# EAGLE design PCB_1 (EAGLE 9.6.2)
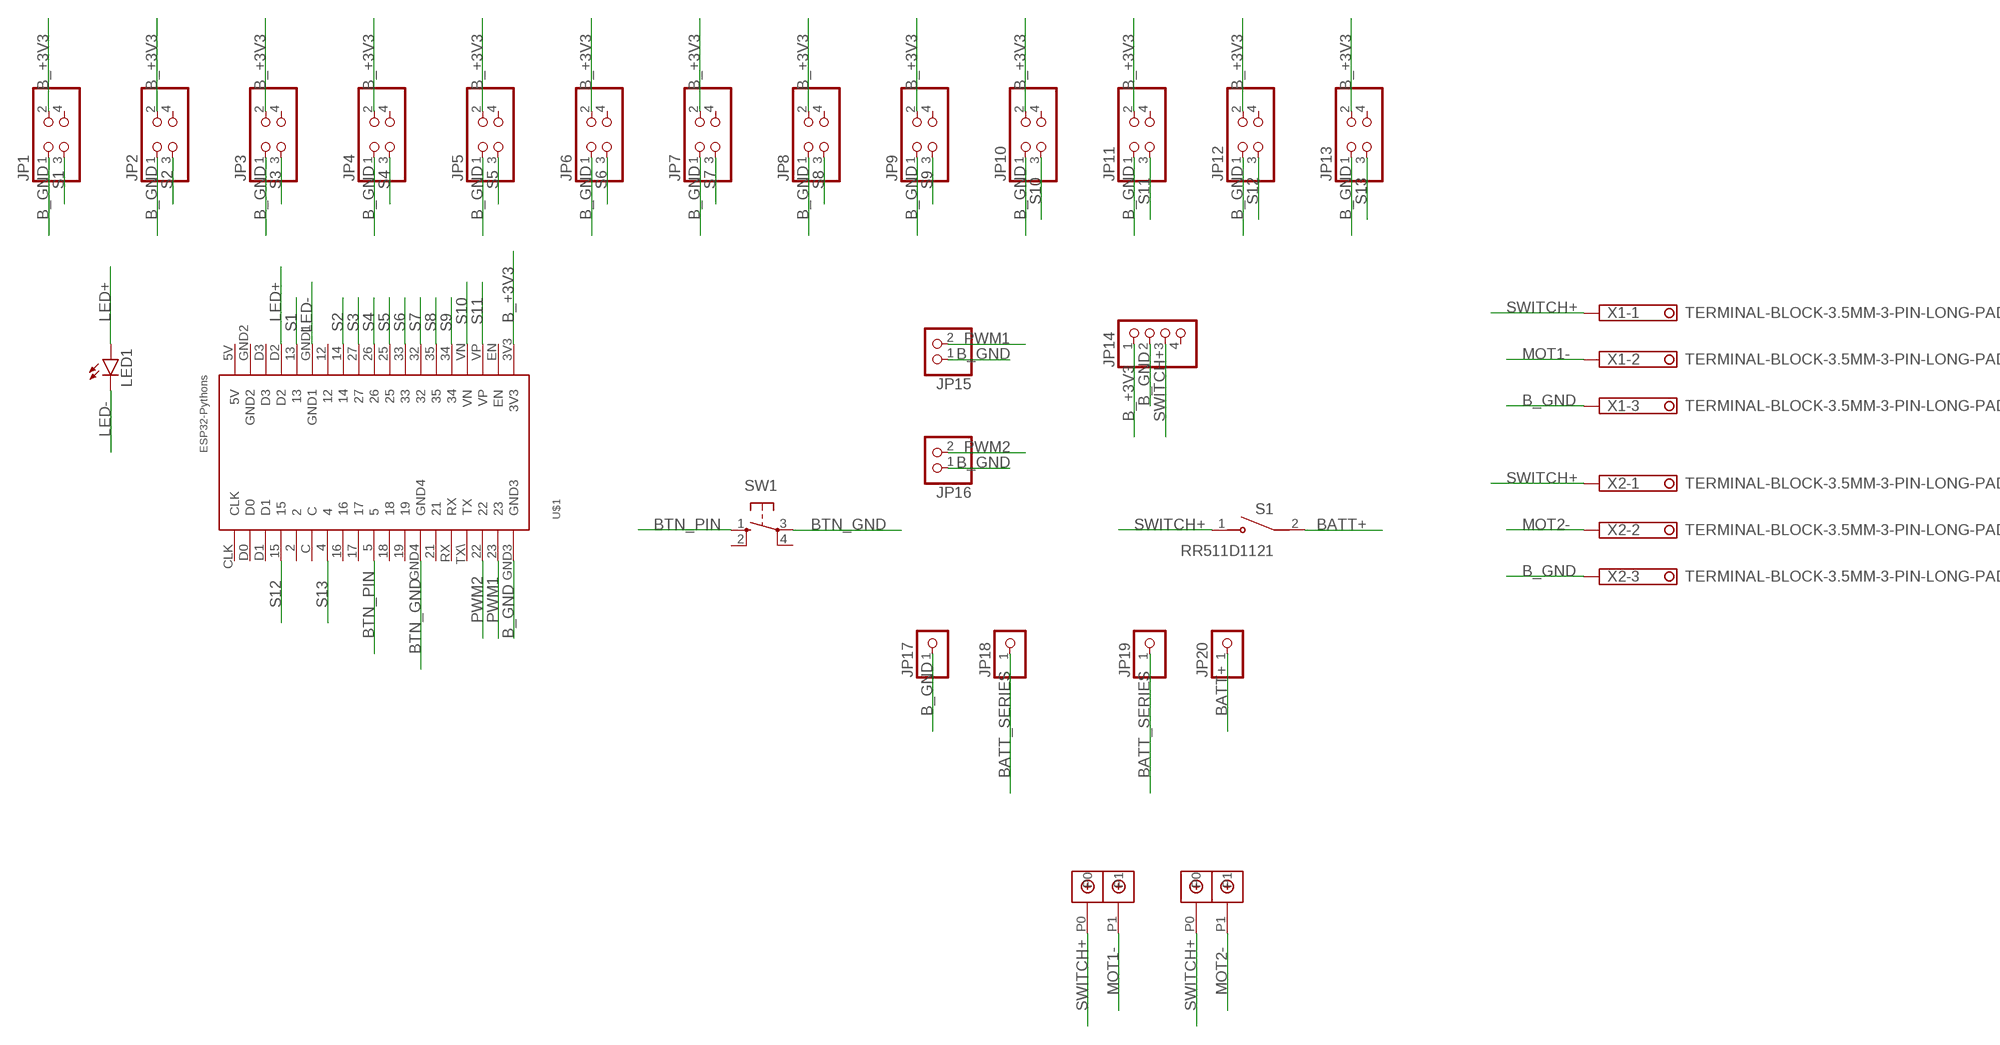
[diagram p0: schematic, sheet 1]

## Parts
JP1  PINHD-2X2  [2X02]
JP2  PINHD-2X2  [2X02]
JP3  PINHD-2X2  [2X02]
JP4  PINHD-2X2  [2X02]
JP5  PINHD-2X2  [2X02]
JP6  PINHD-2X2  [2X02]
JP7  PINHD-2X2  [2X02]
JP8  PINHD-2X2  [2X02]
JP9  PINHD-2X2  [2X02]
JP10  PINHD-2X2  [2X02]
JP11  PINHD-2X2  [2X02]
JP12  PINHD-2X2  [2X02]
JP13  PINHD-2X2  [2X02]
JP14  PINHD-1X4  [1X04]
JP15  PINHD-1X2  [1X02]
JP16  PINHD-1X2  [1X02]
JP17  PINHD-1X1  [1X01]
JP18  PINHD-1X1  [1X01]
JP19  PINHD-1X1  [1X01]
JP20  PINHD-1X1  [1X01]
LED1  LED5MM  [LED5MM]
S1  RR511D1121  [E-SWITCH_RR511D1121]
SW1  10-XX  [B3F-10XX]
U$1  ESP32DEVKITV1  [ESP32-DEVKITV1]
U$2  DBCONN-1X2  [DBCONN-1X2]
U$3  DBCONN-1X2  [DBCONN-1X2]
X1  TERMINAL-BLOCK-3.5MM-3-PIN-LONG-PAD  [TERMINAL-BLOCK-3-PIN-3.5MM-LONG-PAD]
X2  TERMINAL-BLOCK-3.5MM-3-PIN-LONG-PAD  [TERMINAL-BLOCK-3-PIN-3.5MM-LONG-PAD]

## Nets
B_+3V3: JP1.2 JP2.2 JP3.2 JP4.2 JP5.2 JP6.2 JP7.2 JP8.2 JP9.2 JP10.2 JP11.2 JP12.2 JP13.2 JP14.1 U$1.3V3
B_GND: JP1.1 JP2.1 JP3.1 JP4.1 JP5.1 JP6.1 JP7.1 JP8.1 JP9.1 JP10.1 JP11.1 JP12.1 JP13.1 JP14.2 JP15.1 JP16.1 JP17.1 U$1.GND3 X1.3 X2.3
BATT+: JP20.1 S1.2(COM)
BATT_SERIES: JP18.1 JP19.1
BTN_GND: SW1.3(P) U$1.GND4
BTN_PIN: SW1.1(S) U$1.5
LED+: LED1.A U$1.D2
LED-: LED1.K(C) U$1.GND1
MOT1-: U$2.P1 X1.2
MOT2-: U$3.P1 X2.2
PWM1: JP15.2 U$1.23
PWM2: JP16.2 U$1.22
S1: JP1.3 U$1.13
S2: JP2.3 U$1.14
S3: JP3.3 U$1.27
S4: JP4.3 U$1.26
S5: JP5.3 U$1.25
S6: JP6.3 U$1.33
S7: JP7.3 U$1.32
S8: JP8.3 U$1.35
S9: JP9.3 U$1.34
S10: JP10.3 U$1.VN
S11: JP11.3 U$1.VP
S12: JP12.3 U$1.15
S13: JP13.3 U$1.4
SWITCH+: JP14.3 S1.1(NO) U$2.P0 U$3.P0 X1.1 X2.1
Unconnected: JP1.4 JP2.4 JP3.4 JP4.4 JP5.4 JP6.4 JP7.4 JP8.4 JP9.4 JP10.4 JP11.4 JP12.4 JP13.4 JP14.4 SW1.2(S1) SW1.4(P1) U$1.2 U$1.5V U$1.12 U$1.16 U$1.17 U$1.18 U$1.19 U$1.21 U$1.C U$1.CLK U$1.D0 U$1.D1 U$1.D3 U$1.EN U$1.GND2 U$1.RX U$1.TX\(TX)

## Library data of the parts
JP1-JP13 = pinhead:PINHD-2X2: PIN HEADER
JP14 = pinhead:PINHD-1X4: PIN HEADER
JP15 JP16 = pinhead:PINHD-1X2: PIN HEADER
JP17-JP20 = pinhead:PINHD-1X1: PIN HEADER
LED1 = led:LED: LED OSRAM: - CHIPLED LG R971, LG N971, LY N971, LG Q971, LY Q971, LO R971, LY R971 LH N974, LH R974 LS Q976, LO Q976, LY Q976 LO Q996 - Hyper CHIPLED LW Q18S LB Q993, LB Q99A, LB R99A - SideLED LS A670, LO A670, LY A670, LG A670, LP A670 LB A673, LV A673, LT A673, LW A673 LH A674 LY A675 LS A676, LA A676, LO A676, LY A676, LW A676 LS A679, LY A679, LG A679 - Hyper Micro SIDELED® LS Y876, LA Y876, LO Y876, LY Y876 LT Y87S - SmartLED LW L88C, LW L88S LB L89C, LB L89S, LG L890 LS L89K, LO L89K, LY L89K LS L896, LA L896, LO L896, LY L896 - TOPLED LS T670, LO T670, LY T670, LG T670, LP T670 LSG T670, LSP T670, LSY T670, LOP T670, LYG T670 LG T671, LOG T671, LSG T671 LB T673, LV T673, LT T673, LW T673 LH T674 LS T676, LA T676, LO T676, LY T676, LB T676, LH T676, LSB T676, LW T676 LB T67C, LV T67C, LT T67C, LS T67K, LO T67K, LY T67K, LW E67C LS E67B, LA E67B, LO E67B, LY E67B, LB E67C, LV E67C, LT E67C LW T67C LS T679, LY T679, LG T679 LS T770, LO T770, LY T770, LG T770, LP T770 LB T773, LV T773, LT T773, LW T773 LH T774 LS E675, LA E675, LY E675, LS T675 LS T776, LA T776, LO T776, LY T776, LB T776 LHGB T686 LT T68C, LB T68C - Hyper Mini TOPLED® LB M676 - Mini TOPLED Santana® LG M470 LS M47K, LO M47K, LY M47K Source: http://www.osram.convergy.de LUXEON: - LUMILED® LXK2-PW12-R00, LXK2-PW12-S00, LXK2-PW14-U00, LXK2-PW14-V00 LXK2-PM12-R00, LXK2-PM12-S00, LXK2-PM14-U00 LXK2-PE12-Q00, LXK2-PE12-R00, LXK2-PE12-S00, LXK2-PE14-T00, LXK2-PE14-U00 LXK2-PB12-K00, LXK2-PB12-L00, LXK2-PB12-M00, LXK2-PB14-N00, LXK2-PB14-P00, LXK2-PB14-Q00 LXK2-PR12-L00, LXK2-PR12-M00, LXK2-PR14-Q00, LXK2-PR14-R00 LXK2-PD12-Q00, LXK2-PD12-R00, LXK2-PD12-S00 LXK2-PH12-R00, LXK2-PH12-S00 LXK2-PL12-P00, LXK2-PL12-Q00, LXK2-PL12-R00 Source: www.luxeon.com KINGBRIGHT: KA-3528ASYC Source: www.kingbright.com
S1 = RR511D1121:RR511D1121: Check availability <https://pricing.snapeda.com/parts/RR511D1121/E-Switch/view-part?ref=eda>; AVAILABILITY: In Stock; CHECK_PRICES: https://www.snapeda.com/parts/RR511D1121/E-Switch/view-part/?ref=eda; DESCRIPTION: Rocker Switch, RR5 Series, SPST,OFF-ON,Blk Rocker,I/O Legend, 20A, 125VAC, | E-Switch RR511D1121; MF: E-Switch; MP: RR511D1121; PACKAGE: None; PRICE: None; PURCHASE-URL: https://www.snapeda.com/api/url_track_click_mouser/?unipart_id=351624&manufacturer=E-Switch&part_name=RR511D1121&search_term=None; SNAPEDA_LINK: https://www.snapeda.com/parts/RR511D1121/E-Switch/view-part/?ref=snap
SW1 = buttons:10-XX: OMRON SWITCH
U$1 = ESP32-DEVKITV1:ESP32DEVKITV1
U$2 U$3 = Terminal Block Connector:DBCONN-1X2
X1 X2 = Rembrandt Electronics - Terminal Block 3-5mm v1-0:TERMINAL-BLOCK-3.5MM-3-PIN: Terminal Block 3.5mm Pitch: 3,5 mm Number of pins: 3 Created by Rembrandt Electronics www.rembrandtelectronics.com

## Board
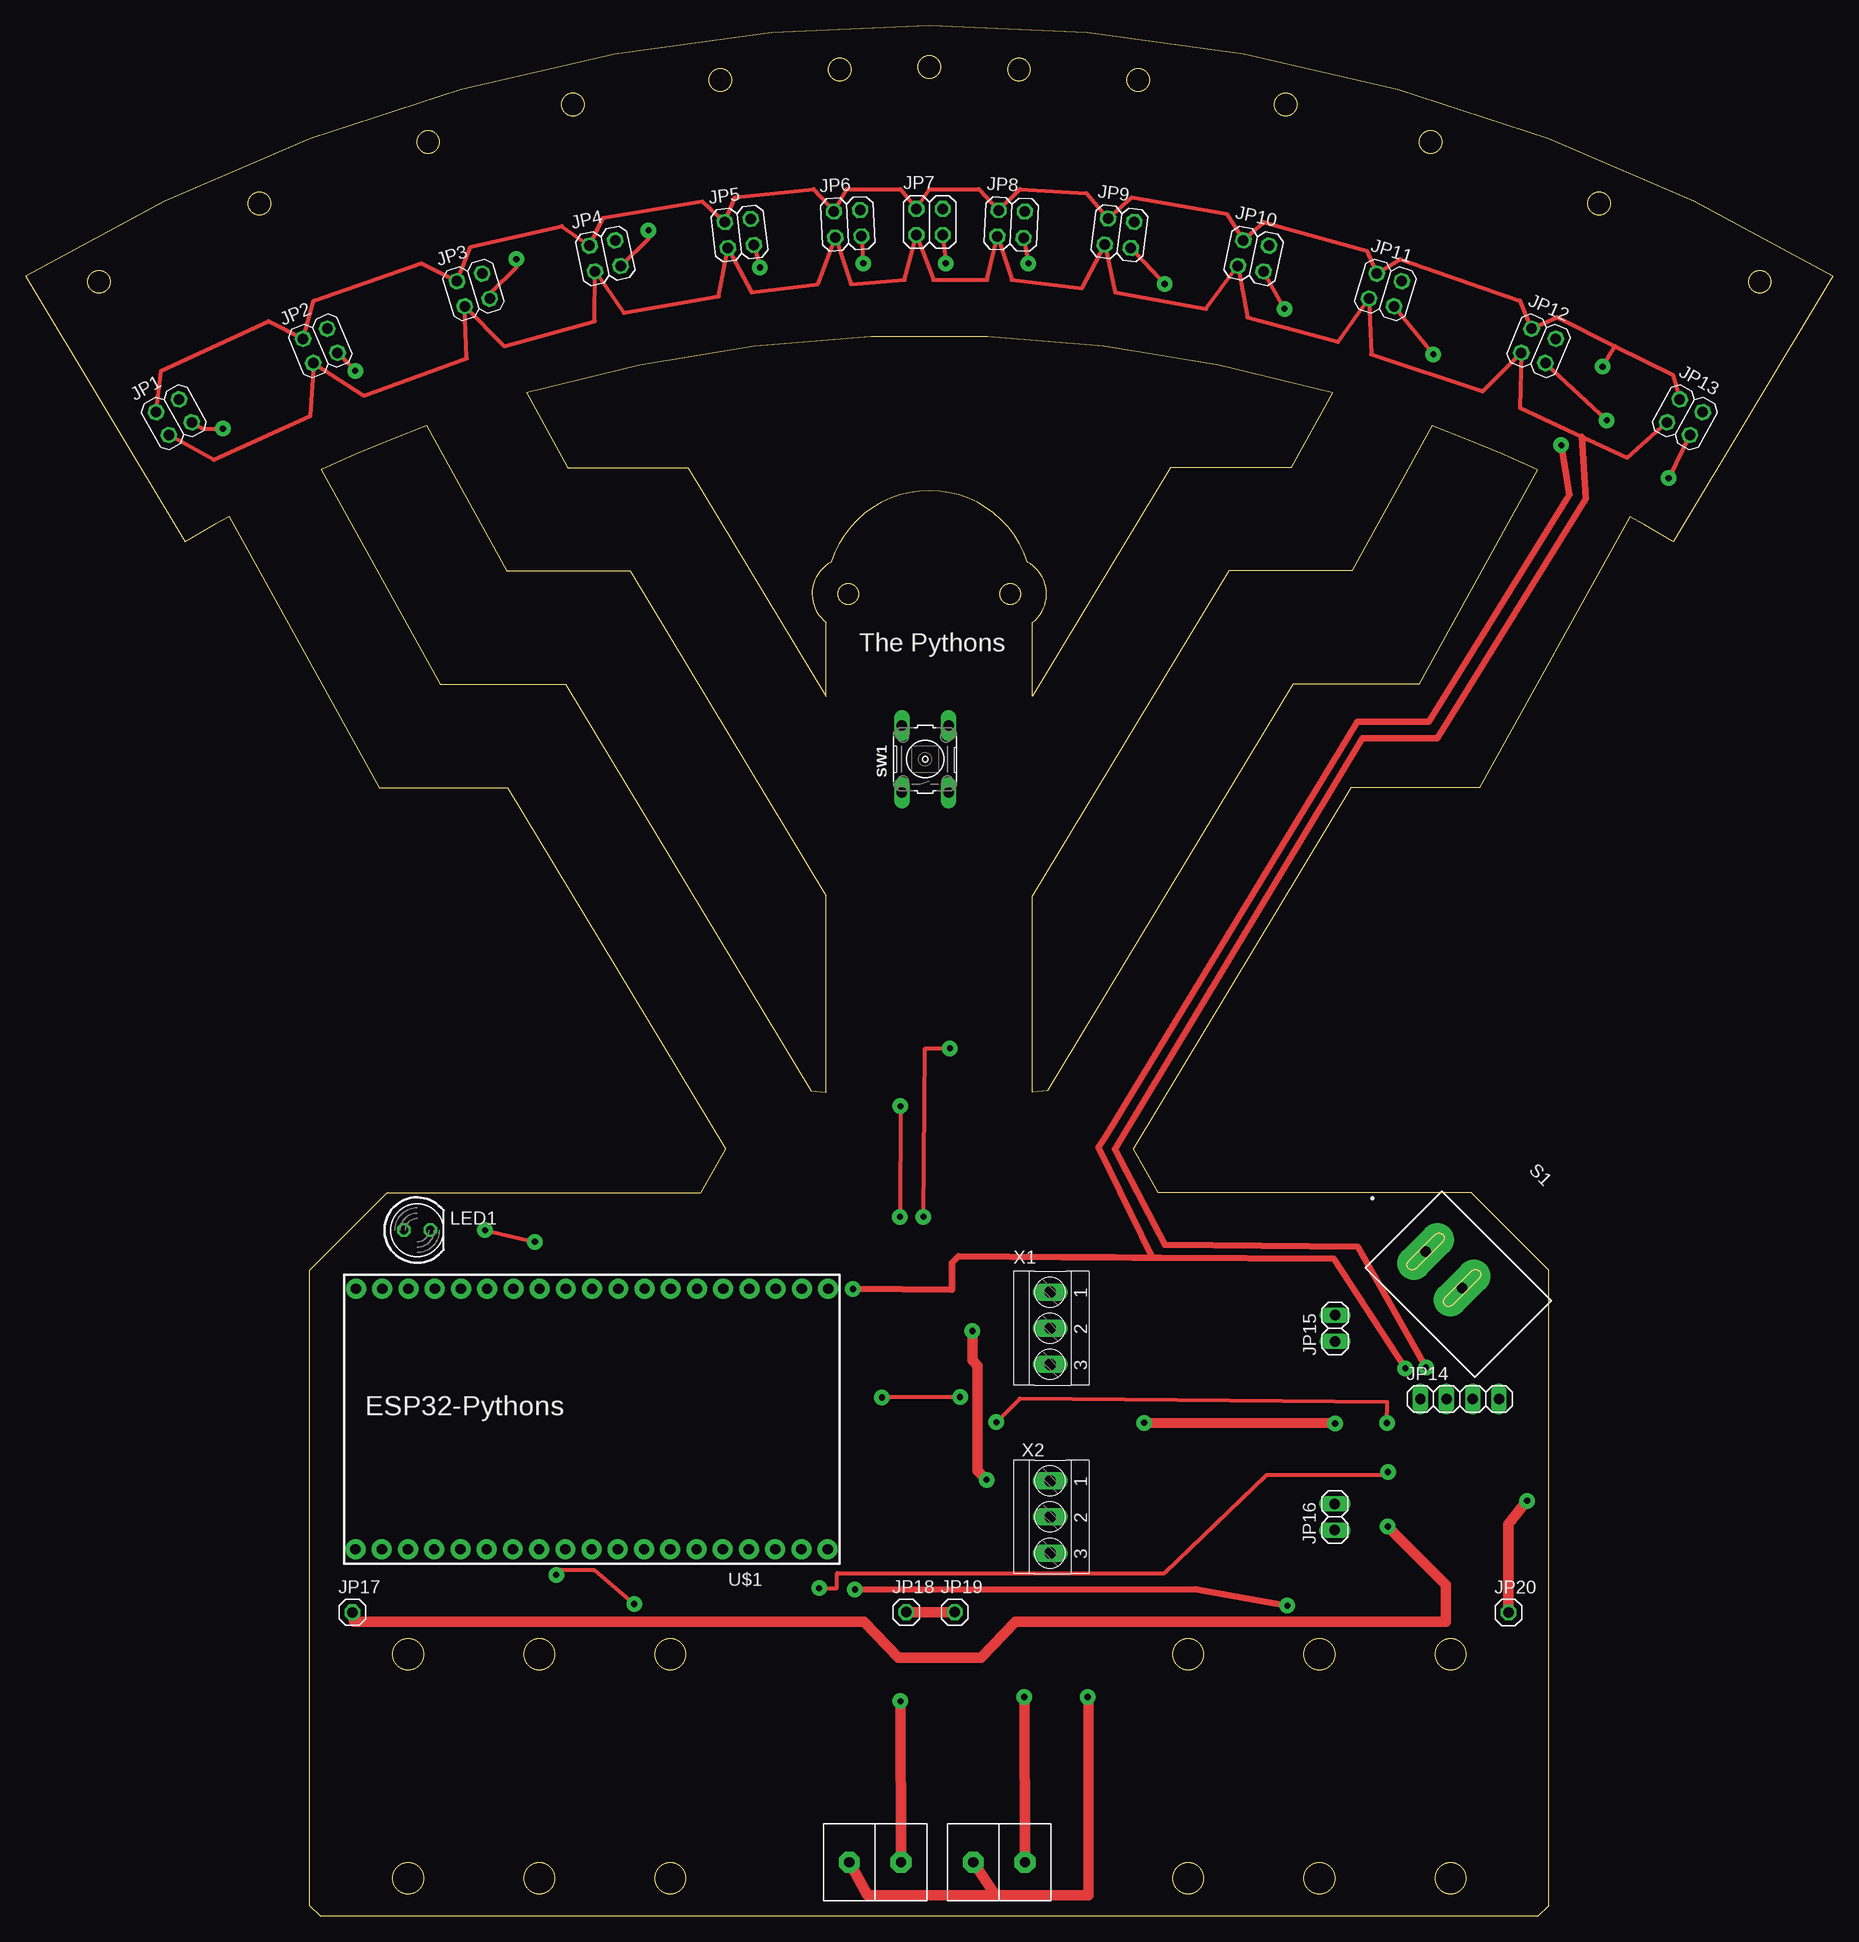
[diagram p1: board, top side]
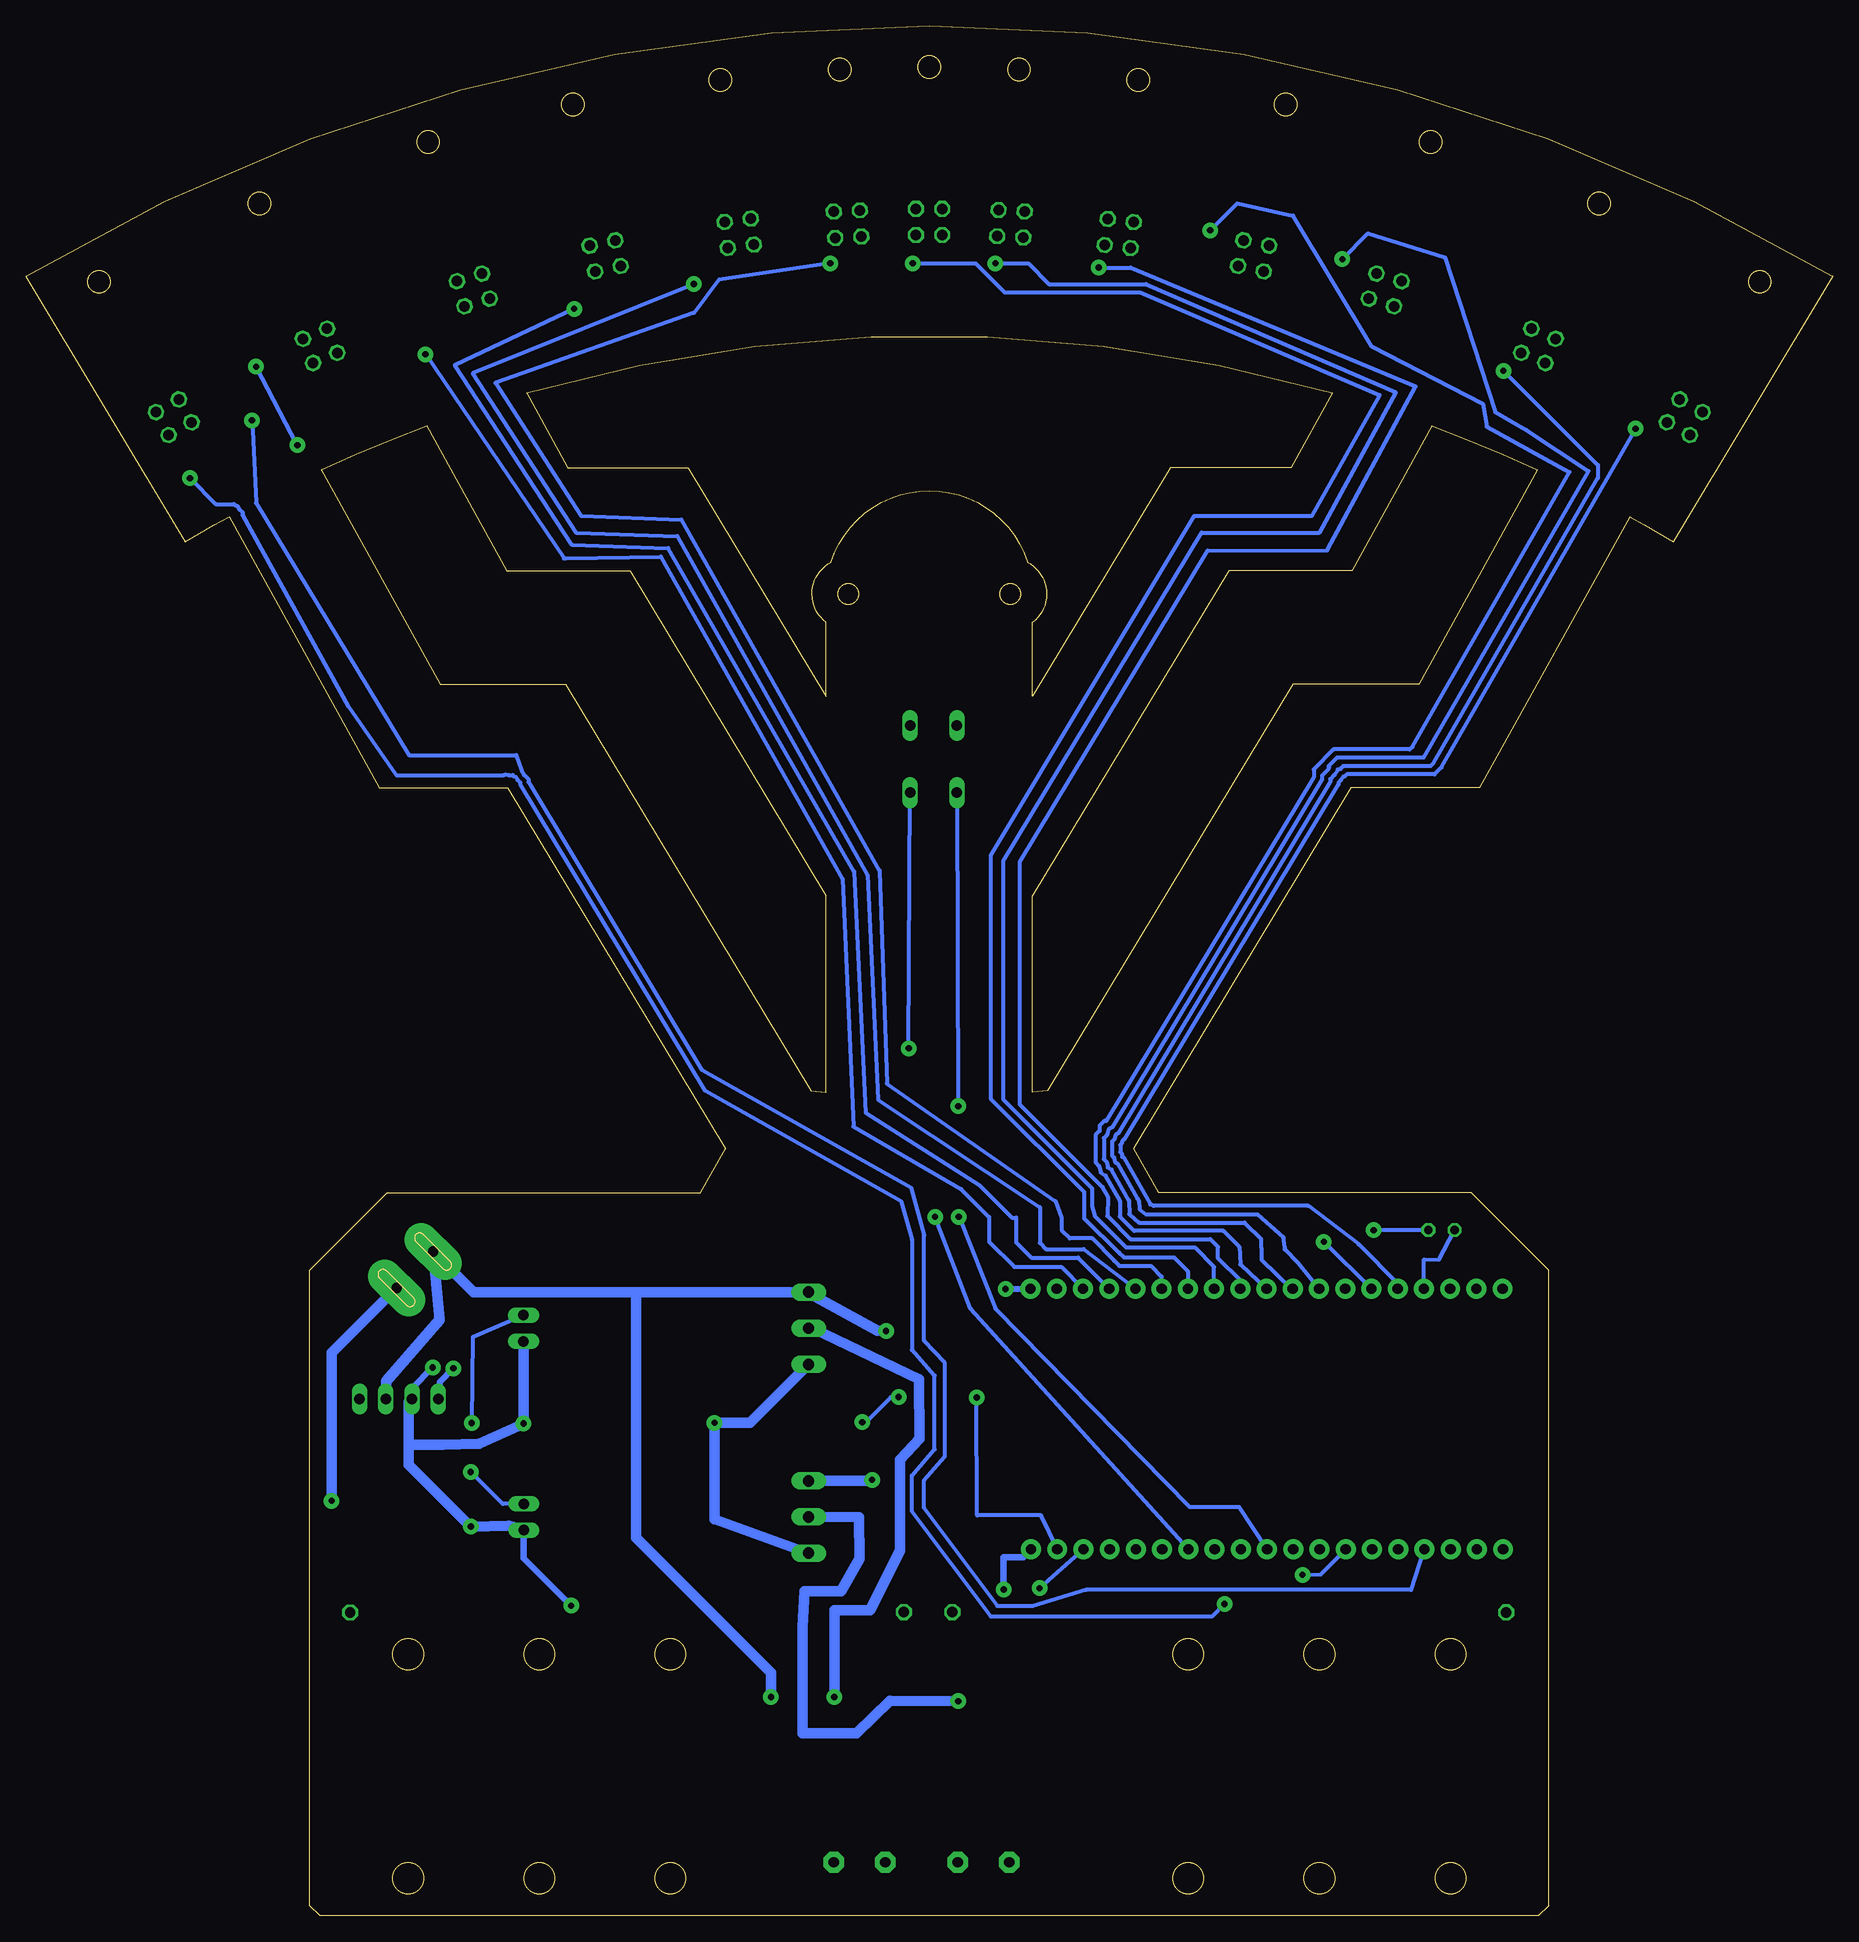
[diagram p2: board, bottom side, seen from below]

Size 175 x 183 mm. Coordinates in mm from the lower left corner, seen from the top.
Outline: 155.33,135.47 155.33,135.47
Outline: 155.33,135.47 140.79,109.23 128.35,109.23 107.25,74.28 109.67,70 140,70 147.5,62.5 147.5,1 146.5,0 28.5,0 27.5,1 27.5,62.5 35,70 65.33,70 67.75,74.28 46.65,109.23 34.21,109.23 19.67,135.47 arc2 15.44,133.03
Outline: 155.33,135.47 arc-2 159.56,133.03 175,158.75 arc62 0,158.75 15.44,133.03
Outline: 15.44,133.03 15.44,133.03
Outline: 97.5,118.11 97.5,125.24 arc114 97.01,131.08 arc144 77.99,131.08 arc114 77.5,125.24 77.5,118.11 64.15,140.23 52.48,140.23 48.48,147.45 arc-32 126.52,147.45 122.52,140.23 110.85,140.23 97.5,118.11
Outline: 28.59,140 40.1,119.23 52.3,119.23 76.04,79.89 77.5,79.76 77.5,98.76 58.51,130.23 46.58,130.23 38.81,144.26 arc5 28.59,140
Outline: 146.41,140 arc5 136.19,144.26 128.42,130.23 116.49,130.23 97.5,98.76 97.5,79.76 98.96,79.89 122.7,119.23 134.9,119.23 146.41,140
Outline: circle at 125.28,25.35 radius 1.5
Outline: circle at 137.97,25.35 radius 1.5
Outline: circle at 37.02,25.35 radius 1.5
Outline: circle at 49.73,25.35 radius 1.5
Outline: circle at 62.42,25.35 radius 1.5
Outline: circle at 112.58,25.35 radius 1.5
Outline: circle at 125.28,3.65 radius 1.5
Outline: circle at 37.02,3.65 radius 1.5
Outline: circle at 49.73,3.65 radius 1.5
Outline: circle at 62.42,3.65 radius 1.5
Outline: circle at 95.35,128 radius 1
Outline: circle at 167.92,158.22 radius 1.09
Outline: circle at 152.36,165.8 radius 1.09
Outline: circle at 136.03,171.75 radius 1.09
Outline: circle at 122.01,175.37 radius 1.09
Outline: circle at 107.73,177.76 radius 1.09
Outline: circle at 96.19,178.77 radius 1.09
Outline: circle at 87.5,179 radius 1.09
Outline: circle at 78.81,178.77 radius 1.09
Outline: circle at 67.27,177.76 radius 1.09
Copper layers (1*16): Top 0.035mm / dielectric 1.5mm / Bottom 0.035mm
Design rules "default *": minimum track width 0.4mm, minimum drill 0.35mm, track to track 0.4mm, track to pad 0.4mm, pad to pad 0.4mm, via to via 0.4mm, smd to smd 6mil, copper to edge 40mil, drill to drill 6mil, minimum pad ring 10mil, minimum via ring 8mil, stop-mask expansion 4mil, vias tented up to drill 0mil, thermal gap 10mil

### Footprints (pad centres in the part's own frame; a part is rotated, then mirrored left to right if it is on the bottom)
2X02 = drill 1.016 octagon: 1 -1.27,-1.27; 2 -1.27,1.27; 3 1.27,-1.27; 4 1.27,1.27
1X04 = drill 1.016 long: 1 -3.81,0; 2 -1.27,0; 3 1.27,0; 4 3.81,0
1X02 = drill 1.016 long: 1 -1.27,0; 2 1.27,0
1X01 = drill 1.016 octagon: 1 0,0
LED5MM = drill 0.813 octagon: A -1.27,0; K 1.27,0
E-SWITCH_RR511D1121 = drill 0.98 pad 3.26 long: 1 -5,0; 2 0,0
B3F-10XX = drill 1.016 long: 1 -3.251,2.261; 2 3.251,2.261; 3 -3.251,-2.261; 4 3.251,-2.261
ESP32-DEVKITV1 = drill 1 pad 1.93: 2 11.47,12.962; 3V3 -24.14,-12.27; 4 6.39,12.962; 5 -1.23,12.962; 5V 21.58,-12.27; 12 6.34,-12.27; 13 11.42,-12.27; 14 3.8,-12.27; 15 14.01,12.962; 16 3.85,12.962; 17 1.31,12.962; 18 -3.77,12.962; 19 -6.31,12.962; 21 -11.39,12.962; 22 -19.01,12.962; 23 -21.55,12.962; 25 -3.82,-12.27; 26 -1.28,-12.27; 27 1.26,-12.27; 32 -8.9,-12.27; 33 -6.36,-12.27; 34 -13.98,-12.27; 35 -11.44,-12.27; C 8.93,12.962; CLK 21.63,12.962; D0 19.09,12.962; D1 16.55,12.962; D2 13.96,-12.27; D3 16.5,-12.27; EN -21.6,-12.27; GND1 8.88,-12.27; GND2 19.04,-12.27; GND3 -24.09,12.962; GND4 -8.85,12.962; RX -13.93,12.962; TX\ -16.47,12.962; VN -16.52,-12.27; VP -19.06,-12.27
DBCONN-1X2 = drill 1 pad 2 octagon: P0 -2.54,0; P1 2.46,0
TERMINAL-BLOCK-3-PIN-3.5MM-LONG-PAD = drill 1.1 pad 1.7 long: 1 -3.5,-0.1; 2 0,-0.1; 3 3.5,-0.1

### Placement (x,y rotation side)
JP1  14.34,145.11 29 top
JP2  28.52,152.02 23 top
JP3  43.35,157.43 17 top
JP4  56.1,160.73 12 top
JP5  69.11,162.89 7 top
JP6  79.6,163.83 3 top
JP7  87.52,164.01 0 top
JP8  95.42,163.8 357 top
JP9  105.91,162.92 353 top
JP10  118.89,160.73 348 top
JP11  131.67,157.43 343 top
JP12  146.5,152.02 337 top
JP13  160.67,145.11 331 top
JP14  138.87,50.04 0 top
JP15  126.79,56.9 90 top
JP16  126.77,38.63 90 top
JP17  31.63,29.4 0 top
JP18  85.27,29.41 0 top
JP19  89.96,29.41 0 top
JP20  143.59,29.38 0 top
LED1  37.9,66.4 0 top
S1  139.1,60.8 315 top
SW1  87.1,112 90 top
U$1  53.56,48.46 180 top
U$2  94.3,5.2 0 top
U$3  82.3,5.2 0 top
X1  99.29,56.9 270 top
X2  99.29,38.63 270 top

### Tracks (layer width: path | path; a pad name or v marks a point on that pad's centre or on a via)
B_+3V3  (via drill 0.6 pad 1.5)
  Top 0.4: JP1.2 13.1,149.6 23.5,154.4 JP2.2 27.9,156.4 38.3,160 JP3.2 43.1,161.6 51.9,163.6 JP4.2 55.9,164.4 65.5,166 JP5.2 68.7,166.4 76.3,167.2 JP6.2 79.5,167.2 84.7,167.2 JP7.2 87.5,167.2 92.3,167.2 JP8.2 96.3,167.2 102.7,166.8 JP9.2 107.1,166.4 116.3,164.8 JP10.2 119.9,164 129.9,161.2 JP11.2 133.1,160.4 144.7,156.4 JP12.2 148.3,154.8 153.9,152 | 153.9,152 159.5,149.2 JP13.2 | 107.28,63.75 107.22,63.75 | v152.7,150 153.9,152
  Top 0.61: v80.11,60.71 89.72,60.64 89.72,63.26 90.33,63.87 100.3,63.8 100.7,63.8 102.29,63.78 105.5,63.76 107.22,63.75 | 109.5,63.73 109.9,63.73 126.67,63.61 v133.6,53.02 | 109.5,63.73 109.1,63.73 | 109.5,63.73 109.1,63.73 | 109.1,63.73 107.91,63.74 107.28,63.75 | v148.7,142.4 149.5,137.6 135.9,115.6 128.96,115.6 104.65,75.57 103.9,74.4 109.1,63.73
  Bottom 0.4: v148.7,142.4 v152.7,150
  Bottom 0.61: U$1.3V3 77.72,60.71 80.09,60.69 v80.11,60.71 | JP14.1 135.06,50.95 134.88,51.74 v133.6,53.02
B_GND  (via drill 0.6 pad 1.5)
  Top 0.4: 27.92,150.3 27.58,145.24 18.21,140.98 JP1.1 | 27.92,150.3 32.7,147.2 42.7,150.8 JP3.1 46.3,152 55.1,154.4 JP4.1 57.9,155.2 67.1,156.8 JP5.1 70.3,157.2 76.7,158 JP6.1 79.9,158 85.1,158.4 JP7.1 87.9,158.4 93.1,158.4 JP8.1 95.5,158.4 102.3,157.6 JP9.1 105.5,157.2 114.3,155.6 JP10.1 118.3,154.8 127.1,152.4 JP11.1 130.3,151.2 141.1,147.6 JP12.1 144.7,146 150.71,143.22 155.1,141.2 JP13.1 | JP2.1 27.92,150.3
  Top 0.61: 150.71,143.22 151.1,137.2 136.7,114 129.42,114 105.49,74.22 110.3,65.01 129.01,64.78 v135.6,53.1 | v80.3,31.6 113.27,31.65 v122.18,30.04
  Top 1.016: JP17.1 31.82,28.48 81.19,28.48 84.5,25 92.5,25 95.82,28.49 137.51,28.49 137.53,32.07 v131.9,37.7 | v126.8,47.67 126.77,47.7 v108.31,47.74
  Bottom 0.61: U$1.GND3 78.4,34.75 80.3,34.75 v80.3,31.6 | JP16.1 126.77,34.63 v122.18,30.04 | JP14.2 137.6,51.1 v135.6,53.1
  Bottom 1.016: JP14.2 137.93,49.71 137.91,45.61 | 137.91,45.61 137.9,43.71 v131.9,37.7 128.23,37.8 JP16.1 | X1.3 104.85,47.74 v108.31,47.74 108.31,38.4 X2.3 | v126.8,47.67 v126.79,47.67 | v126.79,47.67 JP15.1 | v126.79,47.67 131.11,45.7 134.65,45.6 137.91,45.61
BATT+  (via drill 0.6 pad 1.5)
  Top 1.016: v145.39,40.19 143.59,37.91 JP20.1
  Bottom 1.016: S1.2 145.39,54.51 v145.39,40.19
BATT_SERIES
  Top 1.016: JP19.1 JP18.1
BTN_GND  (via drill 0.6 pad 1.5)
  Top 0.4: v86.94,67.69 87.1,84 v89.49,84
  Bottom 0.4: U$1.GND4 83.5,58.8 v86.94,67.69 | v89.49,84 SW1.3
BTN_PIN  (via drill 0.6 pad 1.5)
  Top 0.4: v84.7,78.4 v84.65,67.69
  Bottom 0.4: SW1.1 v84.7,78.4 | v84.65,67.69 81.1,58.8 62.3,39.6 57.5,39.6 U$1.5
LED+
  Bottom 0.4: LED1.A 38.13,63.53 39.6,63.56 U$1.D2
LED-  (via drill 0.6 pad 1.5)
  Top 0.4: v44.47,66.4 v49.29,65.27
  Bottom 0.4: LED1.K v44.47,66.4 | v49.29,65.27 U$1.GND1
MOT1-  (via drill 0.6 pad 1.5)
  Top 1.016: U$2.P1 v96.7,21.2
  Bottom 1.016: v96.7,21.2 96.7,29.6 93.24,29.6 90.35,35.38 90.35,44.16 88.45,46.2 88.48,51.97 98.81,56.9 X1.2
MOT2-  (via drill 0.6 pad 1.5)
  Top 1.016: U$3.P1 v84.7,20.8
  Bottom 1.016: v84.7,20.8 91.32,20.84 94.54,17.67 99.76,17.67 99.76,27.94 99.63,30.57 99.59,31.42 96.05,31.45 94.27,34.58 94.3,38.6 X2.2
PWM1  (via drill 0.6 pad 1.5)
  Top 0.4: v131.82,47.73 131.84,49.74 96.26,50.09 v93.99,47.81 | v82.91,50.2 82.95,50.24 v90.48,50.24
  Bottom 0.4: U$1.23 76.67,38.78 82.87,38.78 v82.91,50.2 | JP15.2 131.72,56.03 v131.82,47.73 | v93.99,47.81 93.63,47.81 91.21,50.23 v90.48,50.24
PWM2  (via drill 0.6 pad 1.5)
  Top 0.4: v131.91,42.99 131.61,42.69 120.16,42.69 110.28,33.2 78.57,33.2 78.56,31.73 v76.83,31.73
  Bottom 0.4: v131.91,42.99 128.82,39.9 JP16.2 | U$1.22 v76.83,31.73
S1  (via drill 0.6 pad 1.5)
  Top 0.4: v19.1,144 17.13,144 JP1.3
  Bottom 0.4: v19.1,144 37.9,111.2 38.56,110.54 47.07,110.54 47.28,110.33 47.44,110.29 47.62,109.99 47.87,109.73 47.87,109.57 68.62,75.19 68.79,75.09 68.88,74.77 69.01,74.64 69.01,73.94 68.89,73.83 68.81,73.5 68.65,73.4 66.1,68.88 65.78,68.76 50.79,68.76 45.9,65.03 42.14,61.2 U$1.13
S2  (via drill 0.6 pad 1.5)
  Top 0.4: v31.9,149.6 31.91,149.61 30.91,150.61 JP2.3
  Bottom 0.4: v31.9,149.6 22.75,140.46 22.75,139.23 38.7,111.6 38.96,111.34 47.41,111.34 47.69,111.06 47.95,110.99 48.26,110.48 48.67,110.07 48.67,109.79 69.2,75.78 69.47,75.63 69.59,75.19 69.81,74.97 69.81,73.61 69.61,73.42 69.51,72.98 69.24,72.83 67.35,69.47 67.22,69.24 67.14,68.43 66.51,67.93 55.72,67.93 53.21,65.71 53.08,64.7 53.08,64.54 51.79,63.23 U$1.14
S3  (via drill 0.6 pad 1.5)
  Top 0.4: v47.5,160.4 47.5,159.6 44.94,157.03 JP3.3
  Bottom 0.4: v47.5,160.4 45,162.9 37.56,160.57 32.7,145.6 29.68,143.86 23.66,139.9 39.64,112.14 48.02,112.14 48.81,111.34 48.81,111.12 48.89,110.98 49.47,110.4 49.47,110.01 69.78,76.37 70.15,76.16 70.31,75.6 70.61,75.3 70.61,73.28 70.34,73.01 70.2,72.47 69.84,72.25 68.15,69.26 68.14,67.94 67.2,67.13 56.97,67.13 55.35,65.52 55.35,64.7 55.32,63.62 55.32,63.52 52.41,60.73 U$1.27
S4  (via drill 0.6 pad 1.5)
  Top 0.4: v60.3,163.2 60.3,162.4 57.65,159.75 JP4.3
  Bottom 0.4: v60.3,163.2 57.68,165.82 52.27,164.62 44.7,152 33.9,146.4 33.51,144.2 25.51,139.78 40.7,113.2 40.96,112.94 48.35,112.94 50.27,111.01 50.27,110.24 70.35,76.97 70.56,76.97 71.01,76.52 71.01,76.06 71.02,76.02 71.41,75.63 71.41,72.95 71.06,72.6 70.9,71.96 70.43,71.67 69.05,69.23 69.05,67.7 67.68,66.33 59.03,66.33 57.48,64.78 57.38,63.08 54.87,60.73 U$1.26
S5  (via drill 0.6 pad 1.5)
  Top 0.4: JP5.3 v71.1,159.6
  Bottom 0.4: v71.1,159.6 67.98,159.6 40.41,148.08 48.99,132.21 60.54,132.2 78.76,102.01 78.76,78.61 70.73,70.57 70.21,69.65 70.27,67.77 68.02,65.52 60.28,65.52 59.53,64.77 59.53,63.67 57.38,61.53 U$1.25
S6  (via drill 0.6 pad 1.5)
  Top 0.4: JP6.3 v81.1,160
  Bottom 0.4: v81.1,160 77.9,160 75.9,158 66.51,158 42.32,147.5 49.72,133.94 61.14,133.93 80.36,102.09 80.36,79.07 71.72,70.43 71.72,68.73 71.42,67.72 68.44,64.72 61.8,64.72 59.92,62.84 U$1.33
S7  (via drill 0.6 pad 1.5)
  Top 0.4: JP7.3 v89.1,160
  Bottom 0.4: v89.1,160 83.01,160 80.21,157.2 67.1,157.2 43.87,147.25 50.46,135.54 61.86,135.54 81.56,102.66 81.56,79.14 72.52,70.1 72.52,67.61 72.52,67.54 69.16,64.23 69.12,64.23 68.64,63.76 63.8,63.76 62.46,62.42 U$1.32
S8  (via drill 0.6 pad 1.5)
  Top 0.4: JP8.3 v97.1,160
  Bottom 0.4: v97.1,160 107.9,158.4 110.3,155.2 129.51,148.42 121.21,135.55 111.5,135.2 92.3,101.2 91.61,80.59 75.29,69.2 74.7,67.6 74.7,66.4 73.9,65.6 71.71,65.6 69.57,63.43 69.09,62.95 66.04,62.95 65,61.91 U$1.35
S9  (via drill 0.6 pad 1.5)
  Top 0.4: JP9.3 v110.3,158
  Bottom 0.4: v110.3,158 131.72,149.36 121.72,133.94 111.9,133.6 93.5,100.8 92.46,79.04 76.8,68.63 76.8,65.17 76.19,64.55 72.53,64.55 67.62,60.83 67.54,60.75 U$1.34
S10  (via drill 0.6 pad 1.5)
  Top 0.4: JP10.3 v121.9,155.6
  Bottom 0.4: v121.9,155.6 133.46,150.16 122.14,132.77 112.78,132.43 94.77,101.12 93.66,77.78 82.62,70.74 79.5,67.61 79.1,67.61 79.1,65.21 77.61,63.73 73.08,63.73 U$1.VN
S11  (via drill 0.6 pad 1.5)
  Top 0.4: JP11.3 v136.3,151.2
  Bottom 0.4: v136.3,151.2 122.87,131.45 122.7,131.45 113.5,131.6 95.9,100.4 94.86,76.43 84.41,70.37 81.7,67.66 81.7,65.26 79.28,62.83 74.73,62.83 U$1.VP
S12  (via drill 0.6 pad 1.5)
  Top 0.4: JP12.3 v153.1,144.8
  Bottom 0.4: v153.1,144.8 152.7,136.8 137.9,112.4 127.5,112.4 126.98,110.87 126.74,110.48 126.33,110.07 126.33,109.79 109.49,81.89 89.27,70.48 87.99,65.89 87.99,55.7 86,53.55 86,44.5 87.99,42.2 87.99,39.47 80.9,30 77.5,30 72.3,31.56 40.84,31.56 U$1.15
S13  (via drill 0.6 pad 1.5)
  Top 0.4: JP13.3 v159.1,139.2 | v58.92,30.21 58.86,30.21 55.08,33.45 51.78,33.45 v51.36,33.03
  Bottom 0.4: v159.1,139.2 156.59,136.69 154.82,136.69 154.69,136.56 154.5,136.51 154.34,136.22 154.01,135.89 154.01,135.62 143.76,117.12 139.13,110.45 128.69,110.45 128.55,110.54 128.2,110.45 127.84,110.45 127.72,110.33 127.56,110.29 127.38,109.99 127.13,109.73 127.13,109.57 109.22,79.9 90.22,69.18 89.19,65.48 89.19,54.81 86.99,52.31 86.99,45.18 89.19,42.63 89.19,39.2 81.55,29 60.14,29 60.15,28.98 v58.92,30.21 | v51.36,33.03 49.6,33.07 U$1.4
SWITCH+  (via drill 0.6 pad 1.5)
  Top 1.016: v91.68,56.64 91.68,53.79 92.18,53.29 92.18,43.08 v93.04,42.22 | U$3.P0 81.5,2 93.9,2 | 93.9,2 102.9,2 102.9,21.14 v102.84,21.2 | U$2.P0 93.9,2
  Bottom 1.016: v91.68,56.64 92.54,56.64 99.04,60.24 X1.1 111.49,60.4 115.9,60.4 | X2.1 93.27,42.13 v93.04,42.22 | 115.9,60.4 131.63,60.4 S1.1 134.91,57.74 140.1,51.78 | 115.9,60.4 115.9,36.6 102.84,23.54 v102.84,21.2 | JP14.3 140.1,51.78 | 140.1,51.78

### Text on the board
tNames: The Pythons